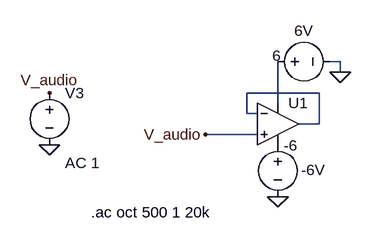
[diagram p0: schematic Suiveur.asc]
Suiveur.asc, the LTspice schematic file:
Version 4
SHEET 1 880 680
WIRE 432 112 416 112
WIRE 432 128 432 112
WIRE 400 160 288 160
WIRE 336 176 336 112
WIRE 288 192 288 160
WIRE 304 192 288 192
WIRE 400 208 400 160
WIRE 400 208 368 208
WIRE 304 224 224 224
FLAG 336 320 0
FLAG 432 128 0
FLAG -16 240 0
FLAG -16 160 V_audio
FLAG 224 224 V_audio
SYMBOL OpAmps\\UniversalOpAmp 336 208 R0
SYMATTR InstName U1
SYMBOL voltage 320 112 R270
WINDOW 0 32 56 VTop 2
WINDOW 3 25 14 VBottom 2
WINDOW 123 0 0 Left 0
WINDOW 39 0 0 Left 0
SYMATTR InstName 6V
SYMATTR Value 6
SYMBOL voltage 336 224 R0
WINDOW 0 36 55 Left 2
WINDOW 3 9 17 Left 2
WINDOW 123 0 0 Left 0
WINDOW 39 0 0 Left 0
SYMATTR InstName -6V
SYMATTR Value -6
SYMBOL voltage -16 144 R0
WINDOW 123 24 124 Left 2
WINDOW 39 0 0 Left 0
SYMATTR InstName V3
SYMATTR Value ""
SYMATTR Value2 AC 1
TEXT 48 344 Left 2 !.ac oct 500 1 20k

The netlist it stands for:
* Suiveur.asc
XU1 V_audio N001 N002 P001 N001 level1 Avol=1Meg GBW=10Meg Vos=0 En=0 Enk=0 In=0 Ink=0 Rin=500Meg  ; pins In+ In- V+ V- OUT
V§6V N002 0 6
V§-6V P001 0 -6
V3 V_audio 0 AC 1
.ac oct 500 1 20k
.lib UniversalOpAmp1.lib
.backanno
.end